# EAGLE design sensor (EAGLE 7.1.0)
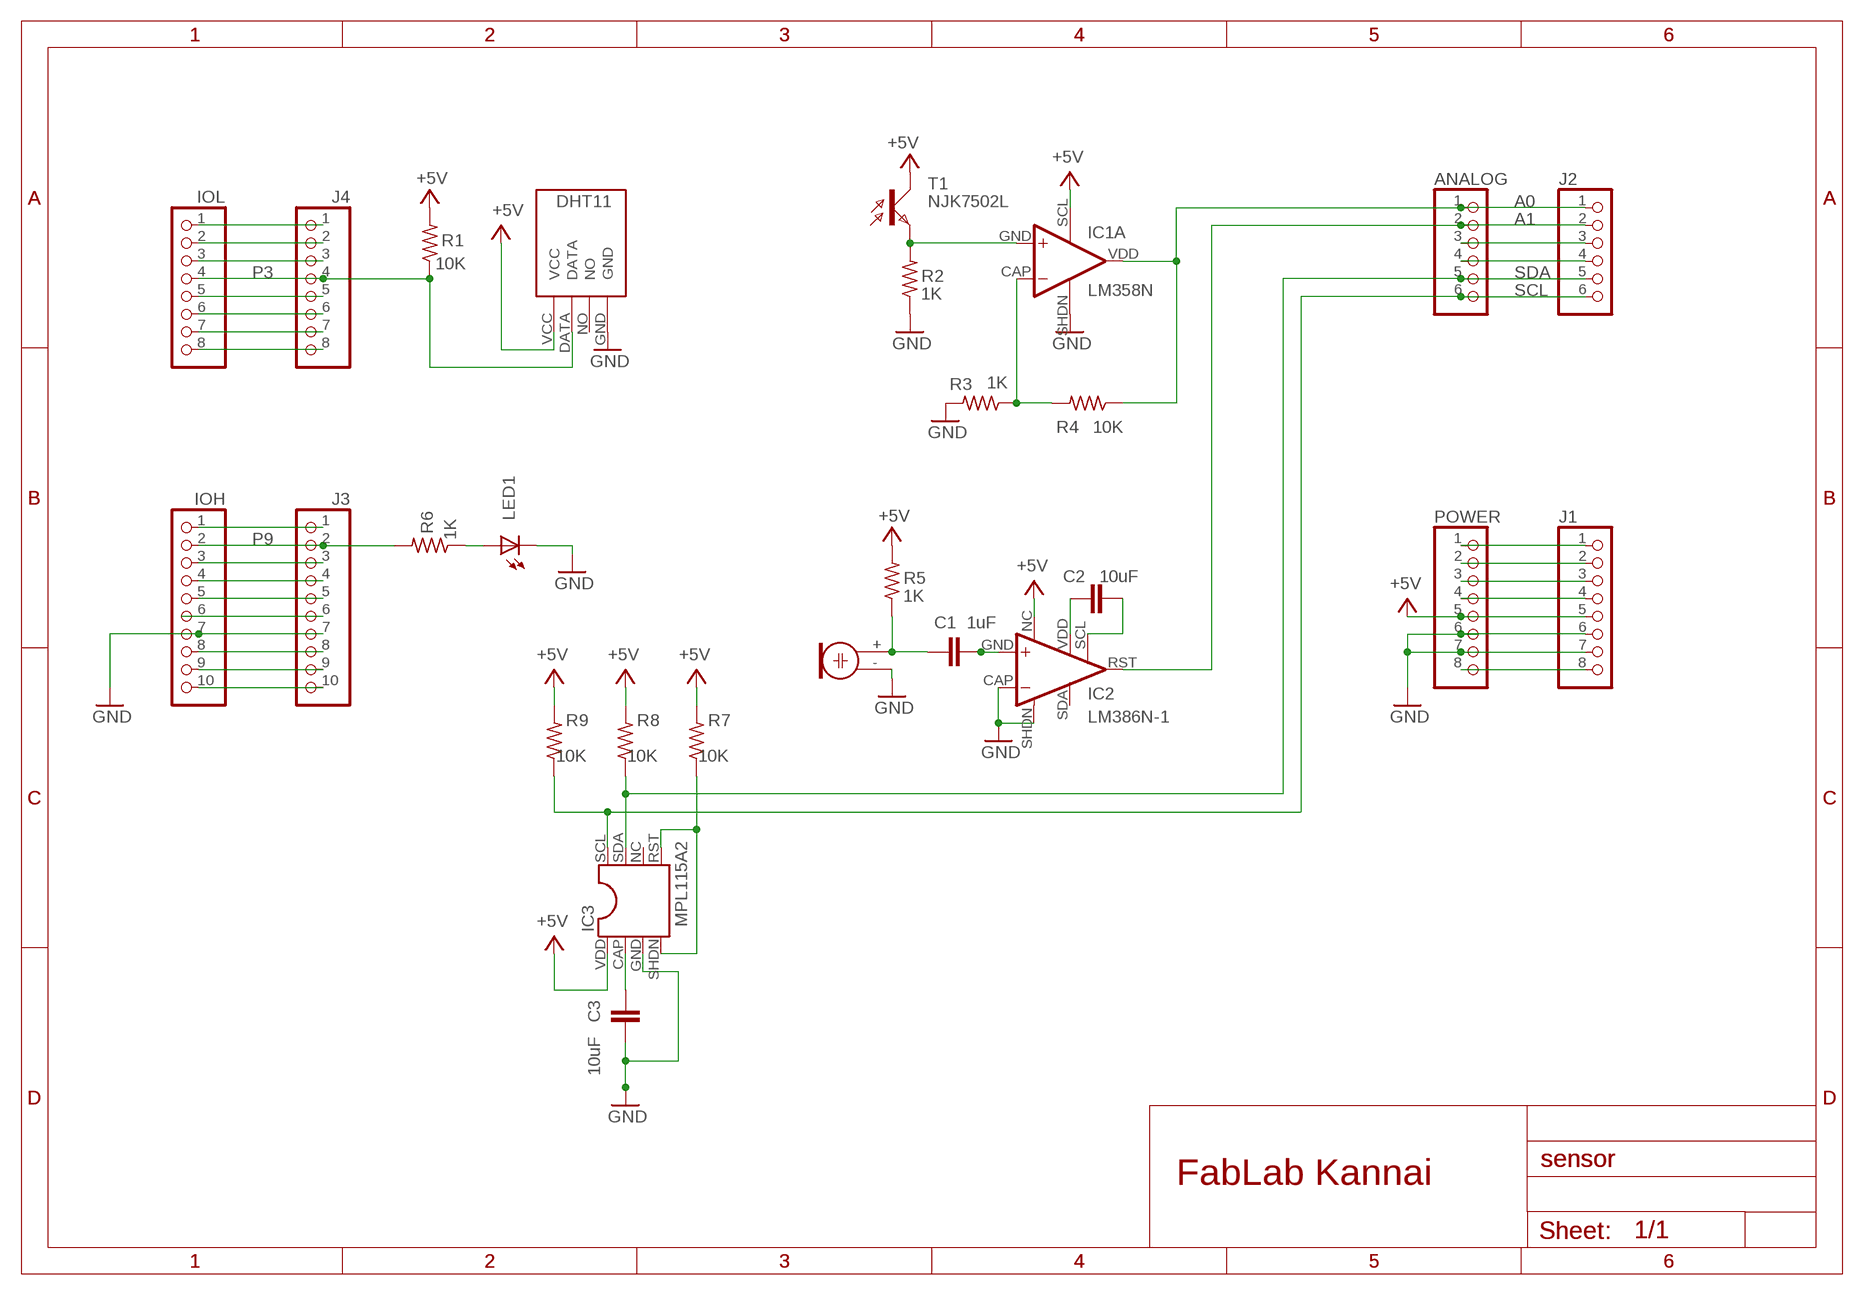
[diagram p0: schematic, sheet 1]

## Parts
ANALOG  PINHD-1X6  [1X06]
C1  1uF  C-EU025-025X050  [C025-025X050]
C2  10uF  C-EU025-025X050  [C025-025X050]
C3  10uF  C-EU025-025X050  [C025-025X050]
IC1  LM358N  [MPL115A2-DIL08]
IC2  LM386N-1  [MPL115A2-DIL08]
IC3  MPL115A2  MPL115A2  [MPL115A2-DIL08]
IOH  PINHD-1X10TH  [1X10-TH]
IOL  PINHD-1X8TH  [1X08-TH]
J1  PINHD-1X8TH  [1X08-TH]
J2  PINHD-1X6  [1X06]
J3  PINHD-1X10TH  [1X10-TH]
J4  PINHD-1X8TH  [1X08-TH]
LED1  LED3MM  [LED3MM]
M1  C9257  C9257""  [DB-C9767]
POWER  PINHD-1X8TH  [1X08-TH]
R1  10K  R-US_0204/7  [0204/7]
R2  1K  R-US_0204/7  [0204/7]
R3  1K  R-US_0204/7  [0204/7]
R4  10K  R-US_0204/7  [0204/7]
R5  1K  R-US_0204/7  [0204/7]
R6  1K  R-US_0204/7  [0204/7]
R7  10K  R-US_0204/7  [0204/7]
R8  10K  R-US_0204/7  [0204/7]
R9  10K  R-US_0204/7  [0204/7]
T1  NJK7502L  [NJL7502L]
U$1  DHT11  [DHT11]

## Nets
+9V: J1.8 POWER.8
A0: ANALOG.1 IC1.VDD(A:OUT) J2.1 R4.1
A1: ANALOG.2 IC2.RST(OUT) J2.2
A2: ANALOG.3 J2.3
A3: ANALOG.4 J2.4
AREF: IOH.8 J3.8
GND: C3.2 IC1.SHDN(P:V-) IC2.CAP(-IN) IC2.SHDN(GND) IC3.GND IOH.7 J1.6 J1.7 J3.7 LED1.K(C) M1.- POWER.6 POWER.7 R2.1 R3.2 U$1.GND
N$1: IOH.9 J3.9
N$2: IOH.10 J3.10
N$4: IC1.SCL(P:V+) IC2.NC(VS) IC3.VDD J1.5 POWER.5 R1.2 R5.2 R7.2 R8.2 R9.2 T1.C U$1.VCC ; supply symbol labelled +5V
N$5: IC1.GND(A:+IN) R2.2 T1.E
N$10: IC3.RST IC3.SHDN R7.1
N$11: IC1.CAP(A:-IN) R3.1 R4.2
N$14: C3.1 IC3.CAP
N$18: C2.1 IC2.VDD(GAIN)
N$31: J1.2 POWER.2
N$32: J1.1 POWER.1
N$73: C1.2 IC2.GND(+IN)
N$77: C2.2 IC2.SCL(GAIN)
N$86: C1.1 M1.+ R5.1
N$103: LED1.A R6.1
N$223: J1.4 POWER.4
P0: IOL.1 J4.1
P1: IOL.2 J4.2
P2: IOL.3 J4.3
P3: IOL.4 J4.4 R1.1 U$1.DATA
P4: IOL.5 J4.5
P5: IOL.6 J4.6
P6: IOL.7 J4.7
P7: IOL.8 J4.8
P8: IOH.1 J3.1
P9: IOH.2 J3.2 R6.2
P10: IOH.3 J3.3
P11: IOH.4 J3.4
P12: IOH.5 J3.5
P13: IOH.6 J3.6
RESET: J1.3 POWER.3
SCL: ANALOG.6 IC3.SCL J2.6 R9.1
SDA: ANALOG.5 IC3.SDA J2.5 R8.1
Unconnected: IC1.NC(B:-IN) IC1.RST(B:+IN) IC1.SDA(B:OUT) IC2.SDA(BYPASS) IC3.NC U$1.NO

## Notes on the sheet
- FabLab Kannai

## Library data of the parts
ANALOG J2 = pinhead:PINHD-1X6: PIN HEADER
C1-C3 = fab-sensor-2:C-EU: CAPACITOR, European symbol; SPICEPREFIX: C
IC1 = fab-sensor-2:LM358: OP AMP also LM158; LM258; LM2904 Source: http://cache.national.com/ds/LM/LM158.pdf
IC2 = fab-sensor-2:LM386?-*: Low Voltage Audio Power Amplifier Source: http://cache.national.com/ds/LM/LM386.pdf
IC3 = fab-sensor-2:MPL115A2: MPL115A2 I2C Digital Barometer http://akizukidenshi.com/catalog/g/gI-04596/
IOH J3 = SmartPrj:PINHD-1X10: PIN HEADER
IOL J1 J4 POWER = SmartPrj:PINHD-1X8: PIN HEADER
LED1 = fab-sensor-2:LED: LED OSRAM: - CHIPLED LG R971, LG N971, LY N971, LG Q971, LY Q971, LO R971, LY R971 LH N974, LH R974 LS Q976, LO Q976, LY Q976 LO Q996 - Hyper CHIPLED LW Q18S LB Q993, LB Q99A, LB R99A - SideLED LS A670, LO A670, LY A670, LG A670, LP A670 LB A673, LV A673, LT A673, LW A673 LH A674 LY A675 LS A676, LA A676, LO A676, LY A676, LW A676 LS A679, LY A679, LG A679 - Hyper Micro SIDELED® LS Y876, LA Y876, LO Y876, LY Y876 LT Y87S - SmartLED LW L88C, LW L88S LB L89C, LB L89S, LG L890 LS L89K, LO L89K, LY L89K LS L896, LA L896, LO L896, LY L896 - TOPLED LS T670, LO T670, LY T670, LG T670, LP T670 LSG T670, LSP T670, LSY T670, LOP T670, LYG T670 LG T671, LOG T671, LSG T671 LB T673, LV T673, LT T673, LW T673 LH T674 LS T676, LA T676, LO T676, LY T676, LB T676, LH T676, LSB T676, LW T676 LB T67C, LV T67C, LT T67C, LS T67K, LO T67K, LY T67K, LW E67C LS E67B, LA E67B, LO E67B, LY E67B, LB E67C, LV E67C, LT E67C LW T67C LS T679, LY T679, LG T679 LS T770, LO T770, LY T770, LG T770, LP T770 LB T773, LV T773, LT T773, LW T773 LH T774 LS E675, LA E675, LY E675, LS T675 LS T776, LA T776, LO T776, LY T776, LB T776 LHGB T686 LT T68C, LB T68C - Hyper Mini TOPLED® LB M676 - Mini TOPLED Santana® LG M470 LS M47K, LO M47K, LY M47K Source: http://www.osram.convergy.de LUXEON: - LUMILED® LXK2-PW12-R00, LXK2-PW12-S00, LXK2-PW14-U00, LXK2-PW14-V00 LXK2-PM12-R00, LXK2-PM12-S00, LXK2-PM14-U00 LXK2-PE12-Q00, LXK2-PE12-R00, LXK2-PE12-S00, LXK2-PE14-T00, LXK2-PE14-U00 LXK2-PB12-K00, LXK2-PB12-L00, LXK2-PB12-M00, LXK2-PB14-N00, LXK2-PB14-P00, LXK2-PB14-Q00 LXK2-PR12-L00, LXK2-PR12-M00, LXK2-PR14-Q00, LXK2-PR14-R00 LXK2-PD12-Q00, LXK2-PD12-R00, LXK2-PD12-S00 LXK2-PH12-R00, LXK2-PH12-S00 LXK2-PL12-P00, LXK2-PL12-Q00, LXK2-PL12-R00 Source: www.luxeon.com KINGBRIGHT: KA-3528ASYC Source: www.kingbright.com
M1 = fab-sensor-2:C9257: Electret Condenser Microphone DB C9767
R1-R9 = fab-sensor-2:R-US_: RESISTOR, American symbol
T1 = fab-sensor-2:NJK7502L: PHOTO TRANSISTOR
U$1 = fab-sensor-2:DHT11: DHT11 Czujnik temperatury i wilgotności

## Board
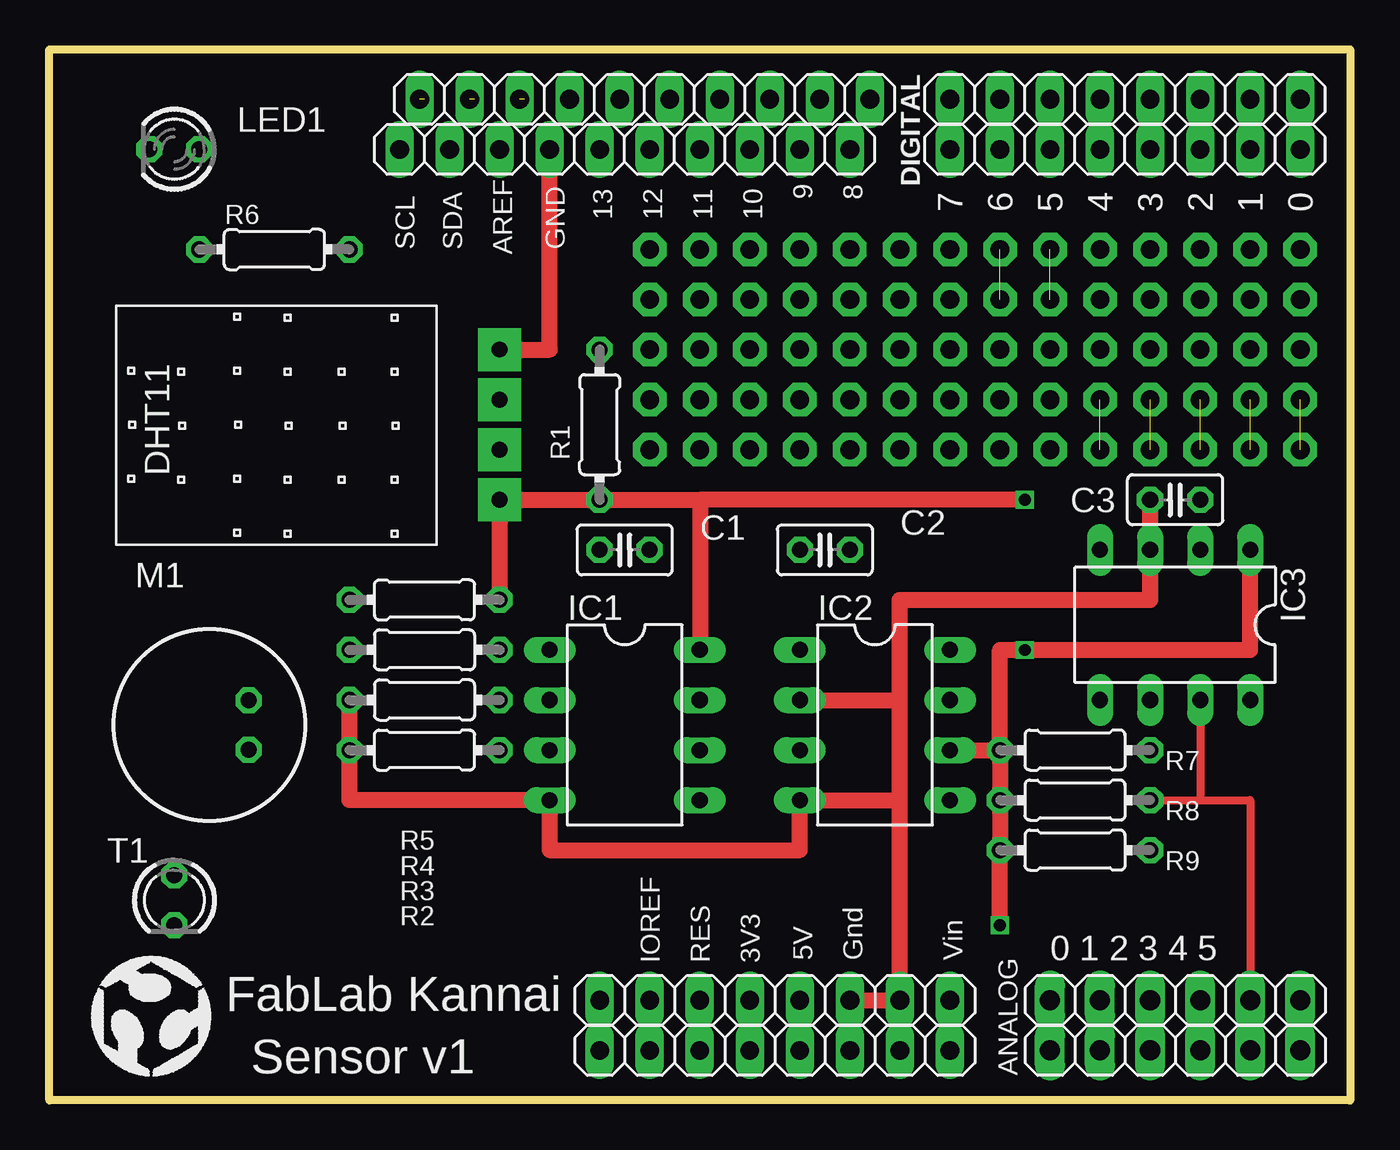
[diagram p1: board, top side]
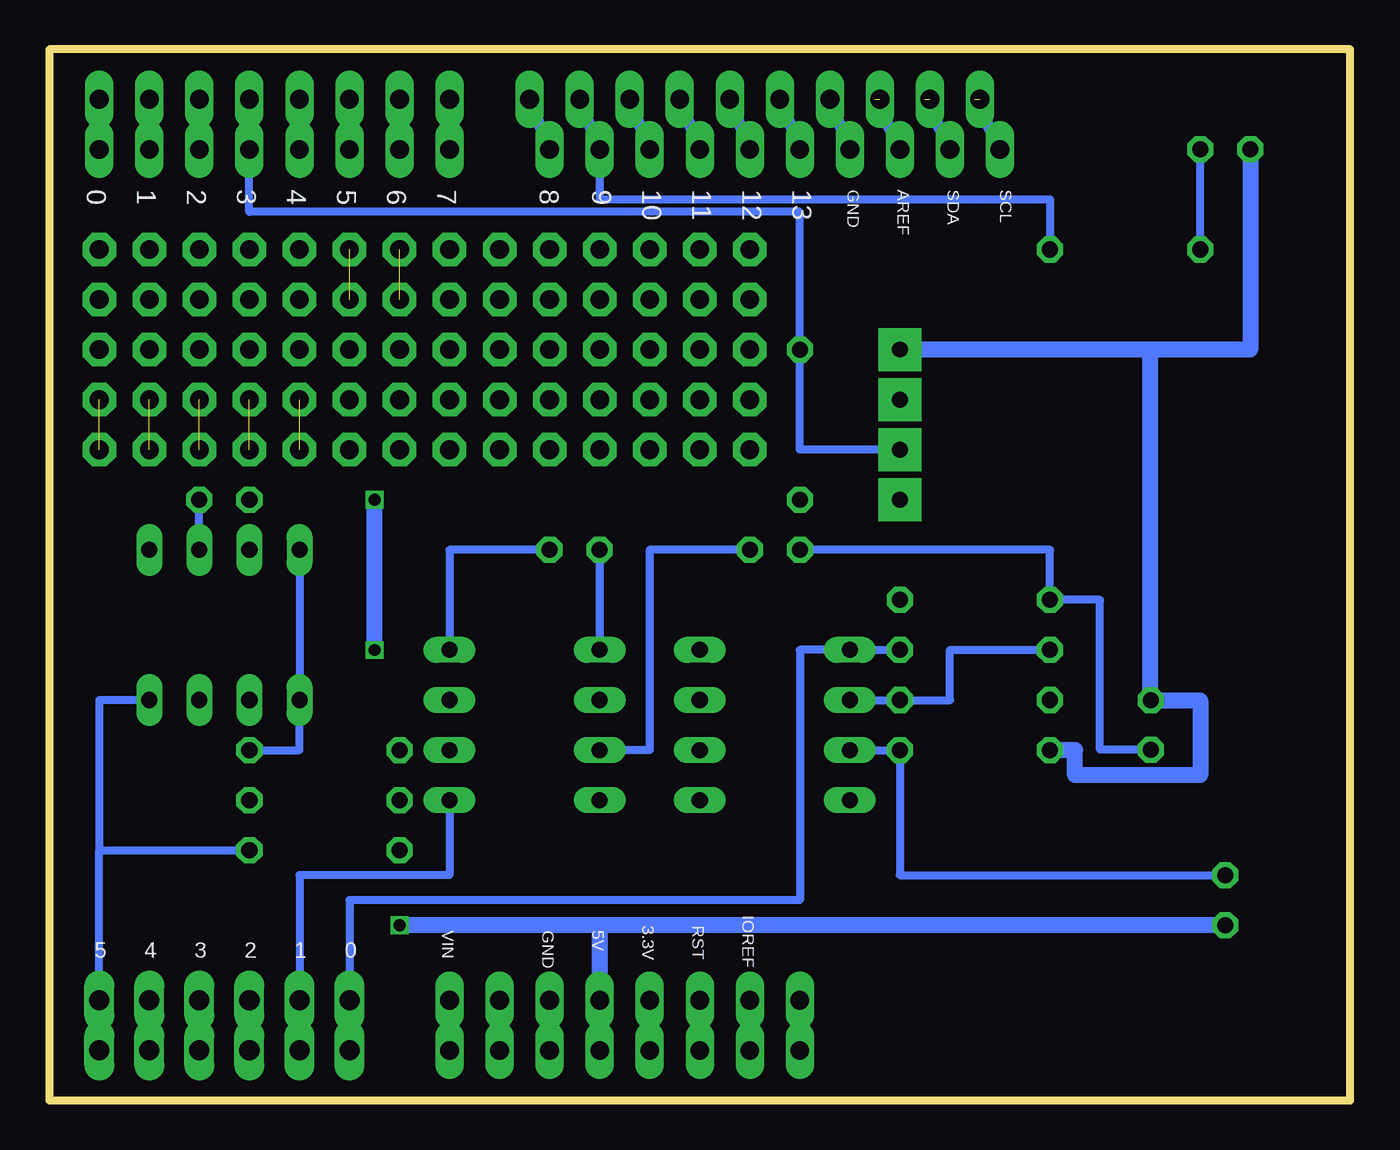
[diagram p2: board, bottom side, seen from below]

Size 66.04 x 53.34 mm. Coordinates in mm from the lower left corner, seen from the top.
Outline: 0,0 0,53.34 66.04,53.34 66.04,0 0,0
Copper layers (1*16): Top 0.035mm / dielectric 1.5mm / Bottom 0.035mm
Design rules "SeeedStudio_2layer_DRU_no_angle_20140221": minimum track width 6mil, minimum drill 12mil, track to track 6mil, track to pad 6mil, pad to pad 6mil, via to via 6mil, smd to smd 0mil, copper to edge 10mil, drill to drill 10mil, minimum pad ring 10mil, minimum via ring 6mil, stop-mask expansion 2mil, vias tented up to drill 100mil, thermal gap 10mil

### Footprints (pad centres in the part's own frame; a part is rotated, then mirrored left to right if it is on the bottom)
1X06 = drill 1.016 long: 1 -6.35,0; 2 -3.81,0; 3 -1.27,0; 4 1.27,0; 5 3.81,0; 6 6.35,0
C025-025X050 = drill 0.813 octagon: 1 -1.27,0; 2 1.27,0
MPL115A2-DIL08 = drill 0.813 long: CAP -1.27,-3.81; GND 1.27,-3.81; NC 1.27,3.81; RST 3.81,3.81; SCL -3.81,3.81; SDA -1.27,3.81; SHDN 3.81,-3.81; VDD -3.81,-3.81
1X10-TH = drill 0.95 pad 1.422 long: 1 -11.43,0; 2 -8.89,0; 3 -6.35,0; 4 -3.81,0; 5 -1.27,0; 6 1.27,0; 7 3.81,0; 8 6.35,0; 9 8.89,0; 10 11.43,0
1X08-TH = drill 0.95 pad 1.422 long: 1 -8.89,0; 2 -6.35,0; 3 -3.81,0; 4 -1.27,0; 5 1.27,0; 6 3.81,0; 7 6.35,0; 8 8.89,0
LED3MM = drill 0.813 octagon: A -1.27,0; K 1.27,0
DB-C9767 = drill 0.813 octagon: + -2,1.25; - -2,-1.25
0204/7 = drill 0.813 octagon: 1 -3.81,0; 2 3.81,0
NJL7502L = drill 0.813 octagon: C 1.27,0; E -1.27,0
DHT11 = drill 0.8 pad 2.184 square: DATA -1.27,-11.43; GND 3.81,-11.43; NO 1.27,-11.43; VCC -3.81,-11.43

### Placement (x,y rotation side)
ANALOG  57.15,2.54 0 top
C1  29.21,27.94 0 top
C2  39.37,27.94 0 top
C3  57.15,30.48 180 top
IC1  29.21,19.05 270 top
IC2  41.91,19.05 270 top
IC3  57.15,24.13 180 top
IOH  30.23,50.8 180 top
IOL  54.61,50.8 180 top
J1  36.83,2.54 0 top
J2  57.15,5.08 0 top
J3  29.21,48.26 180 top
J4  54.61,48.26 180 top
LED1  6.35,48.26 180 top
M1  8.13,19.05 180 top
POWER  36.83,5.08 0 top
R1  27.94,34.29 270 top
R2  19.05,17.78 0 top
R3  19.05,20.32 180 top
R4  19.05,22.86 180 top
R5  19.05,25.4 0 top
R6  11.43,43.18 0 top
R7  52.07,17.78 180 top
R8  52.07,15.24 180 top
R9  52.07,12.7 180 top
T1  6.35,10.16 270 top
U$1  11.43,34.29 90 top

### Tracks (layer width: path | path; a pad name or v marks a point on that pad's centre or on a via)
+9V
  Bottom 0.61: J1.8 POWER.8
A0
  Bottom 0.406: R4.1 IC1.VDD 27.94,22.86 27.94,10.16 50.8,10.16 J2.1
  Bottom 0.61: ANALOG.1 J2.1
A1
  Bottom 0.406: IC2.RST 45.72,11.43 53.34,11.43 J2.2
  Bottom 0.61: ANALOG.2 J2.2
A2
  Bottom 0.61: ANALOG.3 J2.3
A3
  Bottom 0.61: J2.4 ANALOG.4
AREF  (1 unrouted)
  Bottom 0.61: 24.13,50.8 J3.8
GND
  Top 0.813: U$1.GND 25.4,38.1 J3.7 | R3.2 R2.1 15.24,15.24 IC1.SHDN 25.4,12.7 38.1,12.7 IC2.SHDN 43.18,15.24 | J1.6 POWER.6 POWER.7 | J1.7 POWER.7 | C3.2 IC3.GND 55.88,25.4 43.18,25.4 43.18,20.32 | POWER.7 43.18,15.24 | 43.18,15.24 43.18,20.32 | IC2.CAP 43.18,20.32
  Bottom 0.406: M1.- 10.16,20.3 | 7.62,20.3 7.62,20.32
  Bottom 0.61: J3.7 IOH.7
  Bottom 0.813: 10.16,20.3 10.16,38.1 | 10.16,38.1 U$1.GND | M1.- 7.62,20.3 7.62,16.51 13.97,16.51 13.97,17.78 R2.1 | LED1.K 5.08,38.1 10.16,38.1
N$1  (1 unrouted)
  Bottom 0.61: 21.59,50.8 J3.9
N$2  (1 unrouted)
  Bottom 0.61: 19.05,50.8 J3.10
N$4  (via drill 0.6)
  Top 0.813: R5.2 U$1.VCC R1.2 33.02,30.48 | R7.2 R8.2 R9.2 v48.26,8.89 | IC2.NC R7.2 | R7.2 48.26,22.86 v49.53,22.86 60.96,22.86 IC3.VDD | v49.53,30.48 33.02,30.48 | 33.02,30.48 IC1.SCL
  Bottom 0.813: 38.1,8.89 v48.26,8.89 | J1.5 POWER.5 38.1,8.89 | T1.C 38.1,8.89 | v49.53,22.86 v49.53,30.48
N$5
  Bottom 0.406: IC1.GND R2.2 22.86,11.43 T1.E
N$6  (via drill 0.95 pad 1.7)
  other vias: 55.88,38.1
N$7  (via drill 0.95 pad 1.7)
  other vias: 53.34,38.1
N$8  (via drill 0.95 pad 1.7)
  other vias: 50.8,35.56
N$9  (via drill 0.95 pad 1.7)  (1 unrouted)
  other vias: 63.5,35.56 63.5,33.02
N$10
  Bottom 0.406: R7.1 53.34,17.78 IC3.RST IC3.SHDN
N$11
  Bottom 0.406: IC1.CAP R3.1 20.32,20.32 20.32,22.86 R4.2
N$12  (via drill 0.95 pad 1.7)
  other vias: 55.88,40.64
N$13  (via drill 0.95 pad 1.7)
  other vias: 33.02,33.02
N$14
  Bottom 0.406: IC3.CAP C3.1
N$15  (via drill 0.95 pad 1.7)
  other vias: 55.88,43.18
N$16  (via drill 0.95 pad 1.7)
  other vias: 53.34,43.18
N$17  (via drill 0.95 pad 1.7)
  other vias: 48.26,35.56
N$18
  Bottom 0.406: C2.1 IC2.VDD
N$19  (via drill 0.95 pad 1.7)  (1 unrouted)
  other vias: 60.96,35.56 60.96,33.02
N$20  (via drill 0.95 pad 1.7)  (1 unrouted)
  other vias: 58.42,35.56 58.42,33.02
N$21  (via drill 0.95 pad 1.7)  (1 unrouted)
  other vias: 55.88,35.56 55.88,33.02
N$22  (via drill 0.95 pad 1.7)  (1 unrouted)
  other vias: 53.34,35.56 53.34,33.02
N$23  (via drill 0.95 pad 1.7)
  other vias: 50.8,38.1
N$24  (via drill 0.95 pad 1.7)
  other vias: 50.8,33.02
N$25  (via drill 0.95 pad 1.7)
  other vias: 53.34,40.64
N$26  (via drill 0.95 pad 1.7)
  other vias: 33.02,43.18
N$27  (via drill 0.95 pad 1.7)
  other vias: 45.72,43.18
N$28  (via drill 0.95 pad 1.7)
  other vias: 43.18,43.18
N$29  (via drill 0.95 pad 1.7)
  other vias: 40.64,43.18
N$30  (via drill 0.95 pad 1.7)
  other vias: 38.1,43.18
N$31
  Bottom 0.61: J1.2 POWER.2
N$32
  Bottom 0.61: J1.1 POWER.1
N$33  (via drill 0.95 pad 1.7)
  other vias: 35.56,43.18
N$34  (via drill 0.95 pad 1.7)
  other vias: 30.48,43.18
N$35  (via drill 0.95 pad 1.7)
  other vias: 30.48,38.1
N$36  (via drill 0.95 pad 1.7)
  other vias: 45.72,40.64
N$37  (via drill 0.95 pad 1.7)
  other vias: 43.18,40.64
N$38  (via drill 0.95 pad 1.7)
  other vias: 40.64,40.64
N$39  (via drill 0.95 pad 1.7)
  other vias: 38.1,40.64
N$40  (via drill 0.95 pad 1.7)
  other vias: 35.56,40.64
N$41  (via drill 0.95 pad 1.7)
  other vias: 33.02,40.64
N$42  (via drill 0.95 pad 1.7)
  other vias: 30.48,40.64
N$43  (via drill 0.95 pad 1.7)
  other vias: 30.48,35.56
N$44  (via drill 0.95 pad 1.7)
  other vias: 33.02,38.1
N$45  (via drill 0.95 pad 1.7)
  other vias: 45.72,38.1
N$46  (via drill 0.95 pad 1.7)
  other vias: 43.18,38.1
N$47  (via drill 0.95 pad 1.7)
  other vias: 40.64,38.1
N$48  (via drill 0.95 pad 1.7)
  other vias: 38.1,35.56
N$49  (via drill 0.95 pad 1.7)
  other vias: 38.1,38.1
N$50  (via drill 0.95 pad 1.7)
  other vias: 35.56,35.56
N$51  (via drill 0.95 pad 1.7)
  other vias: 35.56,38.1
N$52  (via drill 0.95 pad 1.7)
  other vias: 33.02,35.56
N$53  (via drill 0.95 pad 1.7)
  other vias: 45.72,35.56
N$54  (via drill 0.95 pad 1.7)
  other vias: 45.72,33.02
N$55  (via drill 0.95 pad 1.7)
  other vias: 43.18,35.56
N$56  (via drill 0.95 pad 1.7)
  other vias: 40.64,35.56
N$57  (via drill 0.95 pad 1.7)
  other vias: 43.18,33.02
N$58  (via drill 0.95 pad 1.7)
  other vias: 40.64,33.02
N$59  (via drill 0.95 pad 1.7)
  other vias: 38.1,33.02
N$60  (via drill 0.95 pad 1.7)
  other vias: 35.56,33.02
N$61  (via drill 0.95 pad 1.7)
  other vias: 30.48,33.02
N$62  (via drill 0.95 pad 1.7)  (1 unrouted)
  other vias: 50.8,40.64 50.8,43.18
N$63  (via drill 0.95 pad 1.7)  (1 unrouted)
  other vias: 48.26,40.64 48.26,43.18
N$64  (via drill 0.95 pad 1.7)
  other vias: 48.26,38.1
N$65  (via drill 0.95 pad 1.7)
  other vias: 48.26,33.02
N$73
  Bottom 0.406: C1.2 35.56,27.94 35.56,17.78 IC2.GND
N$77
  Bottom 0.406: C2.2 45.72,27.94 IC2.SCL
N$86
  Bottom 0.406: M1.+ 12.7,17.8 12.7,25.4 R5.1 15.24,27.94 C1.1
N$103
  Bottom 0.406: R6.1 LED1.A
N$189  (via drill 0.95 pad 1.7)
  other vias: 63.5,40.64
N$223
  Bottom 0.61: J1.4 POWER.4
N$404  (via drill 0.95 pad 1.7)
  other vias: 63.5,38.1
N$405  (via drill 0.95 pad 1.7)
  other vias: 60.96,38.1
N$406  (via drill 0.95 pad 1.7)
  other vias: 58.42,38.1
N$424  (via drill 0.95 pad 1.7)
  other vias: 58.42,40.64
N$425  (via drill 0.95 pad 1.7)
  other vias: 60.96,40.64
N$426  (via drill 0.95 pad 1.7)
  other vias: 63.5,43.18
N$427  (via drill 0.95 pad 1.7)
  other vias: 60.96,43.18
N$428  (via drill 0.95 pad 1.7)
  other vias: 58.42,43.18
P0
  Bottom 0.61: J4.1 IOL.1
P1
  Bottom 0.61: J4.2 IOL.2
P2
  Bottom 0.61: J4.3 IOL.3
P3
  Bottom 0.406: U$1.DATA 27.94,33.02 R1.1 27.94,45.09 55.88,45.09 J4.4
  Bottom 0.61: J4.4 IOL.4
P4
  Bottom 0.61: J4.5 IOL.5
P5
  Bottom 0.61: J4.6 IOL.6
P6
  Bottom 0.61: J4.7 IOL.7
P7
  Bottom 0.61: J4.8 IOL.8
P8
  Bottom 0.61: J3.1 IOH.1
P9
  Bottom 0.406: J3.2 38.1,45.72 15.24,45.72 R6.2
  Bottom 0.61: J3.2 IOH.2
P10
  Bottom 0.61: J3.3 IOH.3
P11
  Bottom 0.61: J3.4 IOH.4
P12
  Bottom 0.61: J3.5 IOH.5
P13
  Bottom 0.61: IOH.6 J3.6
RESET
  Bottom 0.61: POWER.3 J1.3
SCL
  Bottom 0.406: J2.6 63.5,12.7 | IC3.SCL 63.5,20.32 63.5,12.7 | 63.5,12.7 R9.1
  Bottom 0.61: ANALOG.6 J2.6
SDA
  Top 0.406: IC3.SDA 58.42,15.24 | 58.42,15.24 60.96,15.24 J2.5 | R8.1 58.42,15.24
  Top 0.813: J2.5 ANALOG.5

### Text on the board
tPlace: 9 | 8 | 13 | 12 | 11 | 10 | 7 | 6 | 5 | 4 | 3 | 2 | 1 | 0 | SCL | SDA | AREF | GND | IOREF | RES | 3V3 | 5V | Gnd | Vin | 0 1 2 3 4 5 | FabLab Kannai | Sensor v1
bPlace: SCL | SDA | AREF | GND | 13 | 12 | 11 | 10 | 9 | 8 | 7 | 6 | 5 | 4 | 3 | 2 | 1 | 0 | IOREF | RST | 3.3V | 5V | GND | VIN | 0 | 1 | 2 | 3 | 4 | 5
tNames: DIGITAL